# Altium schematic sheet Motherboard.SchDoc
size A; SheetNumber: 11; SheetTotal: 17
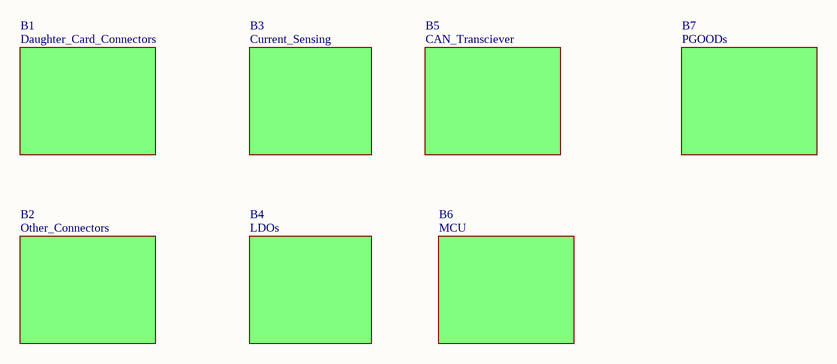
[diagram p0: Motherboard.SchDoc]

## Sub-sheets
B1 = Daughter_Card_Connectors: no entries
B2 = Other_Connectors: no entries
B3 = Current_Sensing: no entries
B4 = LDOs: no entries
B5 = CAN_Transciever: no entries
B6 = MCU: no entries
B7 = PGOODs: no entries